# Altium schematic sheet Latch - AMS.SchDoc
size A4
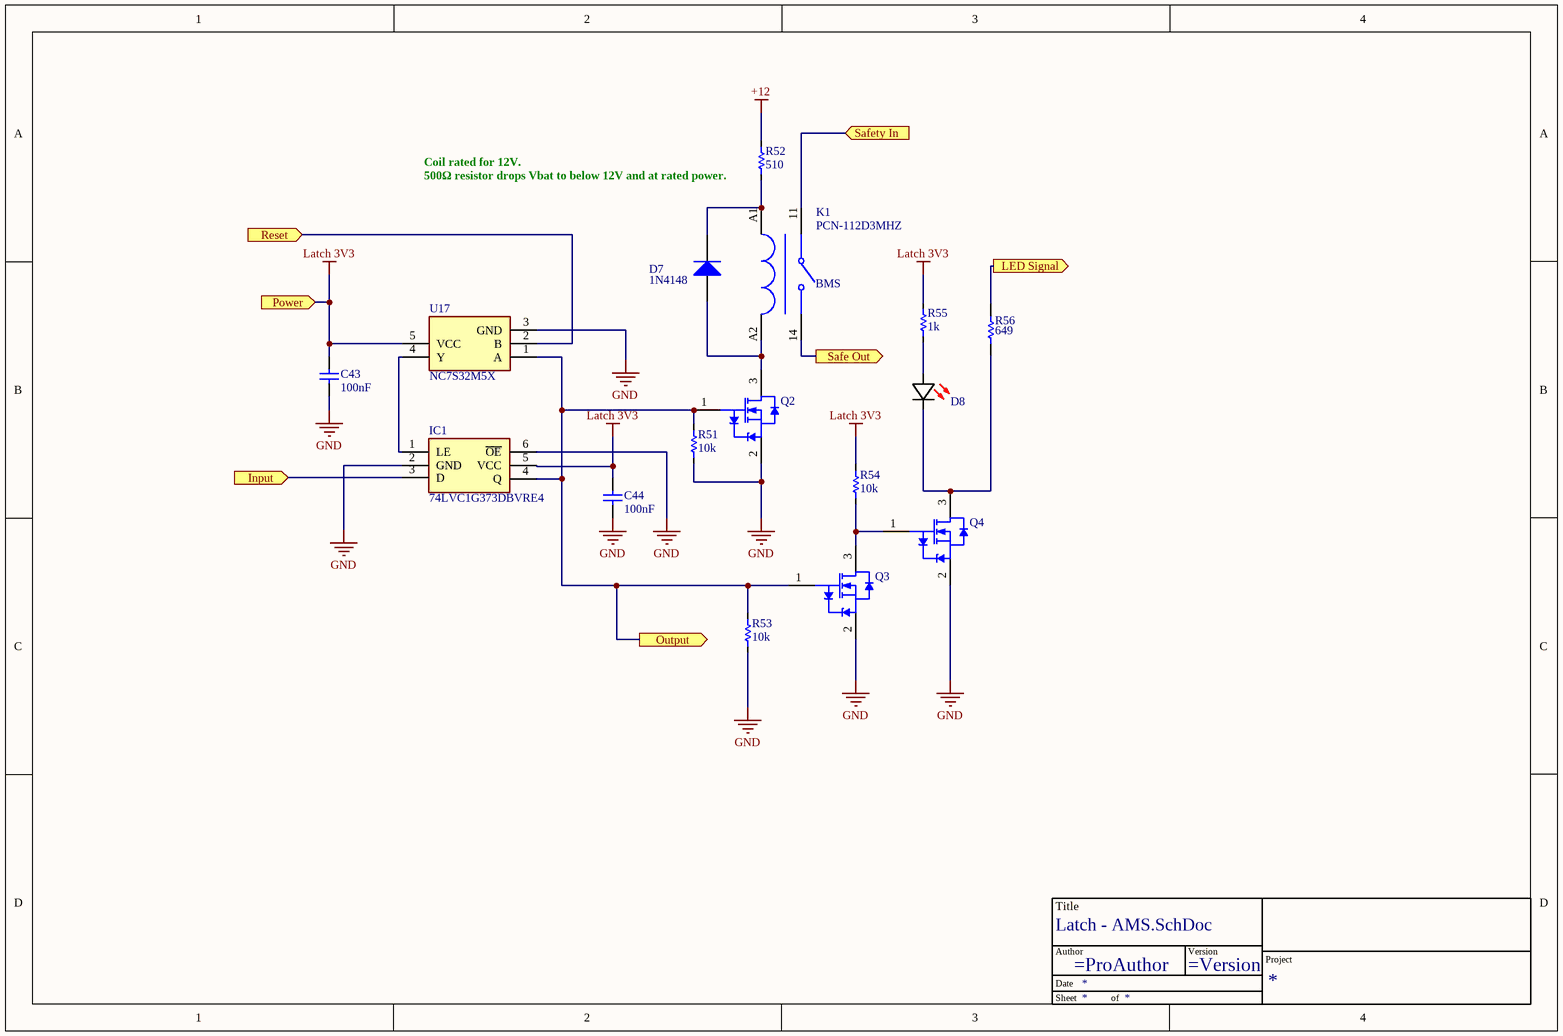
[diagram p0: Latch - AMS.SchDoc]

## Parts
*?  TitleBlock  (value not drawn)  (graphical)
C43  value 100nF  [C_0603]  (hidden comment: C0603C104K3RAC7013)
C44  value 100nF  [C_0603]  (hidden comment: C0603C104K3RAC7013)
D7  1N4148  [425]
D8  150060SS55040  [LED (0603)]  (value not drawn)
IC1  74LVC1G373DBVRE4  [SN74LVC1G373]
K1  PCN-112D3MHZ  [PCN-112D3MHZ]
Q2  BSS138BK,215  [NXP-SOT23_N]  (value not drawn)
Q3  BSS138BK,215  [NXP-SOT23_N]  (value not drawn)
Q4  BSS138BK,215  [NXP-SOT23_N]  (value not drawn)
R51  value 10k  [R-0603]  (hidden comment: RC0603FR-1310KL)
R52  value 510  [R_0805]  (hidden comment: RC0805JR-07510RL)
R53  value 10k  [R-0603]  (hidden comment: RC0603FR-1310KL)
R54  value 10k  [R-0603]  (hidden comment: RC0603FR-1310KL)
R55  value 1k  [R-0603]  (hidden comment: CR0603AFX-1001ELF)
R56  value 649  [RESC6332X06N]  (hidden comment: CRCW2512649RFKEG)
U17  NC7S32M5X  [SOT95P275X110-5N]

## Ports
Input (in), LED Signal (out), Output (out), Power (in), Reset (in), Safe Out (out), Safety In (in)

## Nets
+12: R52.2
GND: C43.1 C44.1 IC1.2(GND) IC1.6(~{OE}) Q2.2(S) Q3.2(S) Q4.2(S) R51.1 R53.1 U17.3(GND)
Latch 3V3: C43.2 C44.2 IC1.5(VCC) R54.2 R55.2 U17.5(VCC) ; port Power
Input: IC1.3(D) ; port Input
LED Signal: R56.2 ; port LED Signal
Output: IC1.4(Q) Q2.1(G) Q3.1(G) R51.2 R53.2 U17.1(A) ; port Output
Reset: U17.2(B) ; port Reset
Safe Out: K1.14 ; port Safe Out
Safety In: K1.11 ; port Safety In
NetD7_1: D7.1(A) K1.A2 Q2.3(D)
NetD7_2: D7.2(K) K1.A1 R52.1
NetD8_1: D8.1(K) Q4.3(D) R56.1
NetD8_2: D8.2(A) R55.1
NetIC1_1: IC1.1(LE) U17.4(Y)
NetQ3_3: Q3.3(D) Q4.1(G) R54.1

## Notes on the sheet
- (near R52) Coil rated for 12V.
  500Ω resistor drops Vbat to below 12V and at rated power.
- (near K1) BMS
- (in symbol TitleBlock) Title; Author; Version; Project; Date; Sheet; of

## Library data of the parts
C43 C44 = Capacitor: ComponentLink1Description: New link; ComponentLink1URL: *
D7 = 1N4148W-7-F: DIODE GEN PURP 100V 300MA SOD123; Manufacturer 1: Diodes; Forward Current: 150mA; Element Configuration: Single; Reverse Recovery Time: 4ns; Max Forward Surge Current (Ifsm): 2A; Polarity: Standard; Voltage Rating (DC): 75V; Power Rating: 400mW; Capacitance: 2pF; Peak Reverse Current: 1uA; Forward Voltage: 1.25V; Supplier 1: Digi-Key; Supplier Part Number 1: 1N4148W-FDIDKR-ND; Manufacturer Part Number 1: 1N4148W-7-F; Stock 1: 3523690; Pricing 1: 1=0.16000, 10=0.14600, 25=0.13880, 100=0.06110, 250=0.05868, 500=0.04800, 1000=0.03333 (USD); RoHS: Yes; Mount: Surface Mount; Number of Pins: 2; Weight: 0.000353oz; Contact Plating: Tin,Matte; Min Operating Temperature: -65°C; Max Operating Temperature: 150°C; Voltage: 100V; Packaging: Tape and Reel; Max Repetitive Reverse Voltage (Vrrm): 100V; Peak Non-Repetitive Surge Current: 2A; Current Rating: 150mA; Output Current: 150mA; Max Surge Current: 2A; Package Quantity: 3000; Recovery Time: 4ns; Max Reverse Voltage (DC): 100V; Average Rectified Current: 300mA; Power Dissipation: 400mW; Length: 2.85mm; Height: 1.25mm; Width: 1.7mm; Radiation Hardening: No; REACH SVHC: No SVHC; Lead Free: Lead Free; ComponentLink1URL: https://datasheet.ciiva.com/911/ds30086-911734.pdf?src-supplier=Digi-Key; ComponentLink1Description: https://datasheet.ciiva.com/911/ds30086-911734.pdf?src-supplier=Digi-Key; ComponentLink2URL: https://datasheet.ciiva.com/911/ds30086-911735.pdf?src-supplier=Digi-Key; ComponentLink2Description: https://datasheet.ciiva.com/911/ds30086-911735.pdf?src-supplier=Digi-Key; ComponentLink3URL: https://datasheet.ciiva.com/911/ds30086-911736.pdf?src-supplier=Digi-Key; ComponentLink3Description: https://datasheet.ciiva.com/911/ds30086-911736.pdf?src-supplier=Digi-Key; ComponentLink4URL: https://datasheet.ciiva.com/8300/ds30086-8300392.pdf?src-supplier=Avnet; ComponentLink4Description: https://datasheet.ciiva.com/8300/ds30086-8300392.pdf?src-supplier=Avnet; ComponentLink5URL: https://datasheet.ciiva.com/25919/ds30086-25919609.pdf?src-supplier=Avnet+Europe; ComponentLink5Description: https://datasheet.ciiva.com/25919/ds30086-25919609.pdf?src-supplier=Avnet+Europe; ComponentLink6URL: https://datasheet.ciiva.com/22695/1915529-22695239.pdf?src-supplier=Element14; ComponentLink6Description: https://datasheet.ciiva.com/22695/1915529-22695239.pdf?src-supplier=Element14; ComponentLink7URL: https://datasheet.ciiva.com/1179/1915529-1179304.pdf?src-supplier=Element14; ComponentLink7Description: https://datasheet.ciiva.com/1179/1915529-1179304.pdf?src-supplier=Element14; ComponentLink8URL: https://datasheet.ciiva.com/4435/ds30086-4435128.pdf?src-supplier=Mouser; ComponentLink8Description: https://datasheet.ciiva.com/4435/ds30086-4435128.pdf?src-supplier=Mouser; ComponentLink9URL: https://datasheet.ciiva.com/15219/getdatasheetpartid-110030-15219548.pdf?src-supplier=Verical; ComponentLink9Description: https://datasheet.ciiva.com/15219/getdatasheetpartid-110030-15219548.pdf?src-supplier=Verical; ComponentLink10URL: https://datasheet.ciiva.com/8303/ds30086-8303197.pdf?src-supplier=Avnet; ComponentLink10Description: https://datasheet.ciiva.com/8303/ds30086-8303197.pdf?src-supplier=Avnet
D8 = 150060SS55040: LED RED DIFFUSED 0603 SMD; Manufacturer: Wurth Electronics; Lens Style: Flat; Luminous Intensity: 70mcd; Forward Voltage: 2V; Test Current: 20mA; Viewing Angle: 140°; Dominant Wavelength: 630nm; Lens Size: 0.8mm; Supplier 1: Mouser; Manufacturer Part Number: 150060SS55040; RoHS: No; Category: LEDs; Stock 1: 17006; Pricing 1: 1=0.18000, 10=0.16800, 50=0.16800, 100=0.15200, 1000=0.12100, 10000=0.10600 (USD); Mount: Surface Mount; Case/Package: 0603; Color: Red; Case Code (Imperial): 0603; Case Code (Metric): 1608; Packaging: Tape and Reel; Lens Transparency: Diffused; Length: 1.6mm; Width: 0.8mm; Height: 0.5mm; RoHS Compliant: No; Supplier Part Number 1: 710-150060SS55040
IC1 = 74LVC1G373DBVRE4: Integrated Circuit; Manufacturer_Name: Texas Instruments; Datasheet Link: http://www.ti.com/general/docs/suppproductinfo.tsp?distId=10&gotoUrl=http%3A%2F%2Fwww.ti.com%2Flit%2Fgpn%2Fsn74lvc1g373; Height: 1.45mm; Manufacturer_Part_Number: 74LVC1G373DBVRE4
K1 = PCN-112D3MHZ: Relay
Q2-Q4 = CMP-1259-00087-1: N-Channel Trench MOSFET, 60 V, 0.36 A, -55 to 150 degC, 3-Pin SOT23, Tape and Reel; Manufacturer: NXP Semiconductors; Channel Type: N; IDM [max] (A): 1.2; VDS [max] (V): 60; Packing: Tape & Reel; ID [max] (A): 0.36; Automotive Qualified: Y; VGSth [typ] (V): 1.1; PackageReference: SOT23; Code_JEDEC: TO-236AB; PackageDescription: 3-Pin Small Outline Transistor Package, Body 2.9 x 1.3 mm, Pitch 0.95 mm; ComponentLink2URL: http://www.nxp.com/documents/data_sheet/BSS138BK.pdf; PartNumber: BSS138BK,215; DatasheetVersion: Rev. 1; ComponentLink3Description: Package Specification; ComponentLink3URL: http://www.nxp.com/documents/outline_drawing/sot023_po.pdf; Mounting Technology: Surface Mount; ComponentLink1URL: http://www.nxp.com/; ComponentLink1Description: Manufacturer URL; ComponentLink2Description: Datasheet; PackageVersion: 06-03-16, 03/2006
R51-R55 = Resistor
R56 = CRCW2512649RFKEG: RES SMD 649 OHM 1% 1W 2512; Manufacturer 1: Vishay Dale; Temperature Coefficient: 100ppm/°C; Voltage Rating (DC): 500V; Supplier 1: Digi-Key; Supplier Part Number 1: 541-649AFCT-ND; Manufacturer Part Number 1: CRCW2512649RFKEG; Stock 1: 2166; Pricing 1: 1=0.38000, 10=0.31800, 100=0.12420, 1000=0.05198 (USD); RoHS: Yes; Case/Package: 2512; Case Code (Metric): 6432; Case Code (Imperial): 2512; Min Operating Temperature: -55°C; Max Operating Temperature: 155°C; Package Quantity: 10; Tolerance: 1%; Packaging: Tape and Reel; Composition: Thick Film; Number of Terminations: 2; Features: Automotive AEC-Q200; Max Power Dissipation: 1W; Length: 0.248inch; Height: 0.028inch; Width: 0.124inch; Lead Free: Lead Free
U17 = NC7S32M5X: OR GATEEEE; Manufacturer_Name: ON Semiconductor; Datasheet Link: https://componentsearchengine.com/Datasheets/2/NC7S32M5X.pdf; Height: 1.1mm; Manufacturer_Part_Number: NC7S32M5X